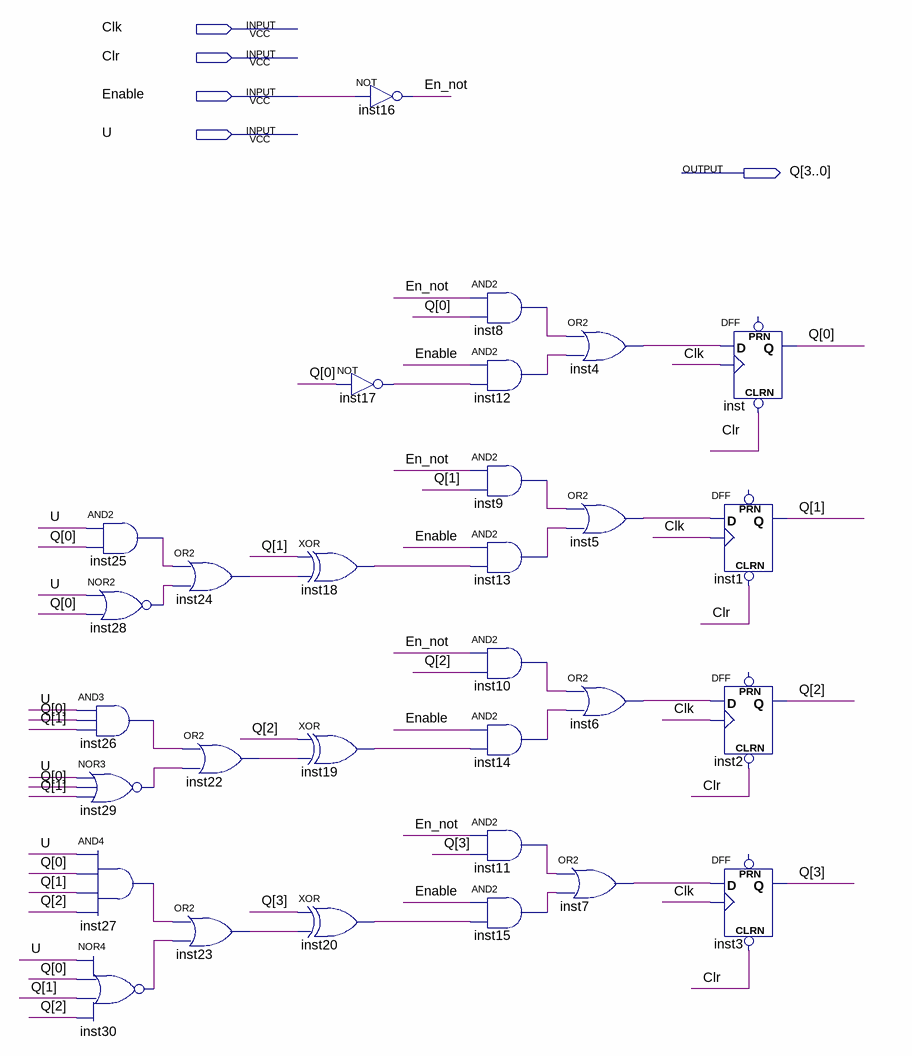
[diagram p0: schematic sheet]
// Quartus schematic up_down_4bit_counter.bdf as structural Verilog: 30 symbols, 5 pins
module up_down_4bit_counter (
  input  Clk,
  input  Clr,
  input  Enable,
  input  U,
  output [3:0] Q
);

  wire En_not, inst4_out, inst5_out, inst6_out, inst7_out, inst8_out, inst9_out, inst10_out, inst11_out,
       inst12_out, inst13_out, inst14_out, inst15_out, inst17_out, inst18_out, inst19_out, inst20_out,
       inst22_out, inst23_out, inst24_out, inst25_out, inst26_out, inst27_out, inst28_out, inst29_out,
       inst30_out;

  and inst26 (inst26_out, U, Q[0], Q[1]);
  nor inst29 (inst29_out, U, Q[0], Q[1]);
  and inst27 (inst27_out, U, Q[0], Q[1], Q[2]);
  nor inst30 (inst30_out, U, Q[0], Q[1], Q[2]);
  and inst25 (inst25_out, U, Q[0]);
  nor inst28 (inst28_out, U, Q[0]);
  or inst24 (inst24_out, inst25_out, inst28_out);
  or inst22 (inst22_out, inst26_out, inst29_out);
  or inst23 (inst23_out, inst27_out, inst30_out);
  xor inst18 (inst18_out, Q[1], inst24_out);
  xor inst19 (inst19_out, Q[2], inst22_out);
  xor inst20 (inst20_out, Q[3], inst23_out);
  not inst16 (En_not, Enable);
  not inst17 (inst17_out, Q[0]);
  and inst8 (inst8_out, En_not, Q[0]);
  and inst12 (inst12_out, Enable, inst17_out);
  and inst9 (inst9_out, En_not, Q[1]);
  and inst13 (inst13_out, Enable, inst18_out);
  and inst10 (inst10_out, En_not, Q[2]);
  and inst14 (inst14_out, Enable, inst19_out);
  and inst11 (inst11_out, En_not, Q[3]);
  and inst15 (inst15_out, Enable, inst20_out);
  or inst4 (inst4_out, inst8_out, inst12_out);
  or inst5 (inst5_out, inst9_out, inst13_out);
  or inst6 (inst6_out, inst10_out, inst14_out);
  or inst7 (inst7_out, inst11_out, inst15_out);
  DFF inst (.CLRN(Clr), .CLK(Clk), .D(inst4_out), .Q(Q[0]));  // open: PRN
  DFF inst1 (.CLRN(Clr), .CLK(Clk), .D(inst5_out), .Q(Q[1]));  // open: PRN
  DFF inst2 (.CLRN(Clr), .CLK(Clk), .D(inst6_out), .Q(Q[2]));  // open: PRN
  DFF inst3 (.CLRN(Clr), .CLK(Clk), .D(inst7_out), .Q(Q[3]));  // open: PRN
endmodule
